# EAGLE design acf-adapter (EAGLE 9.6.2)
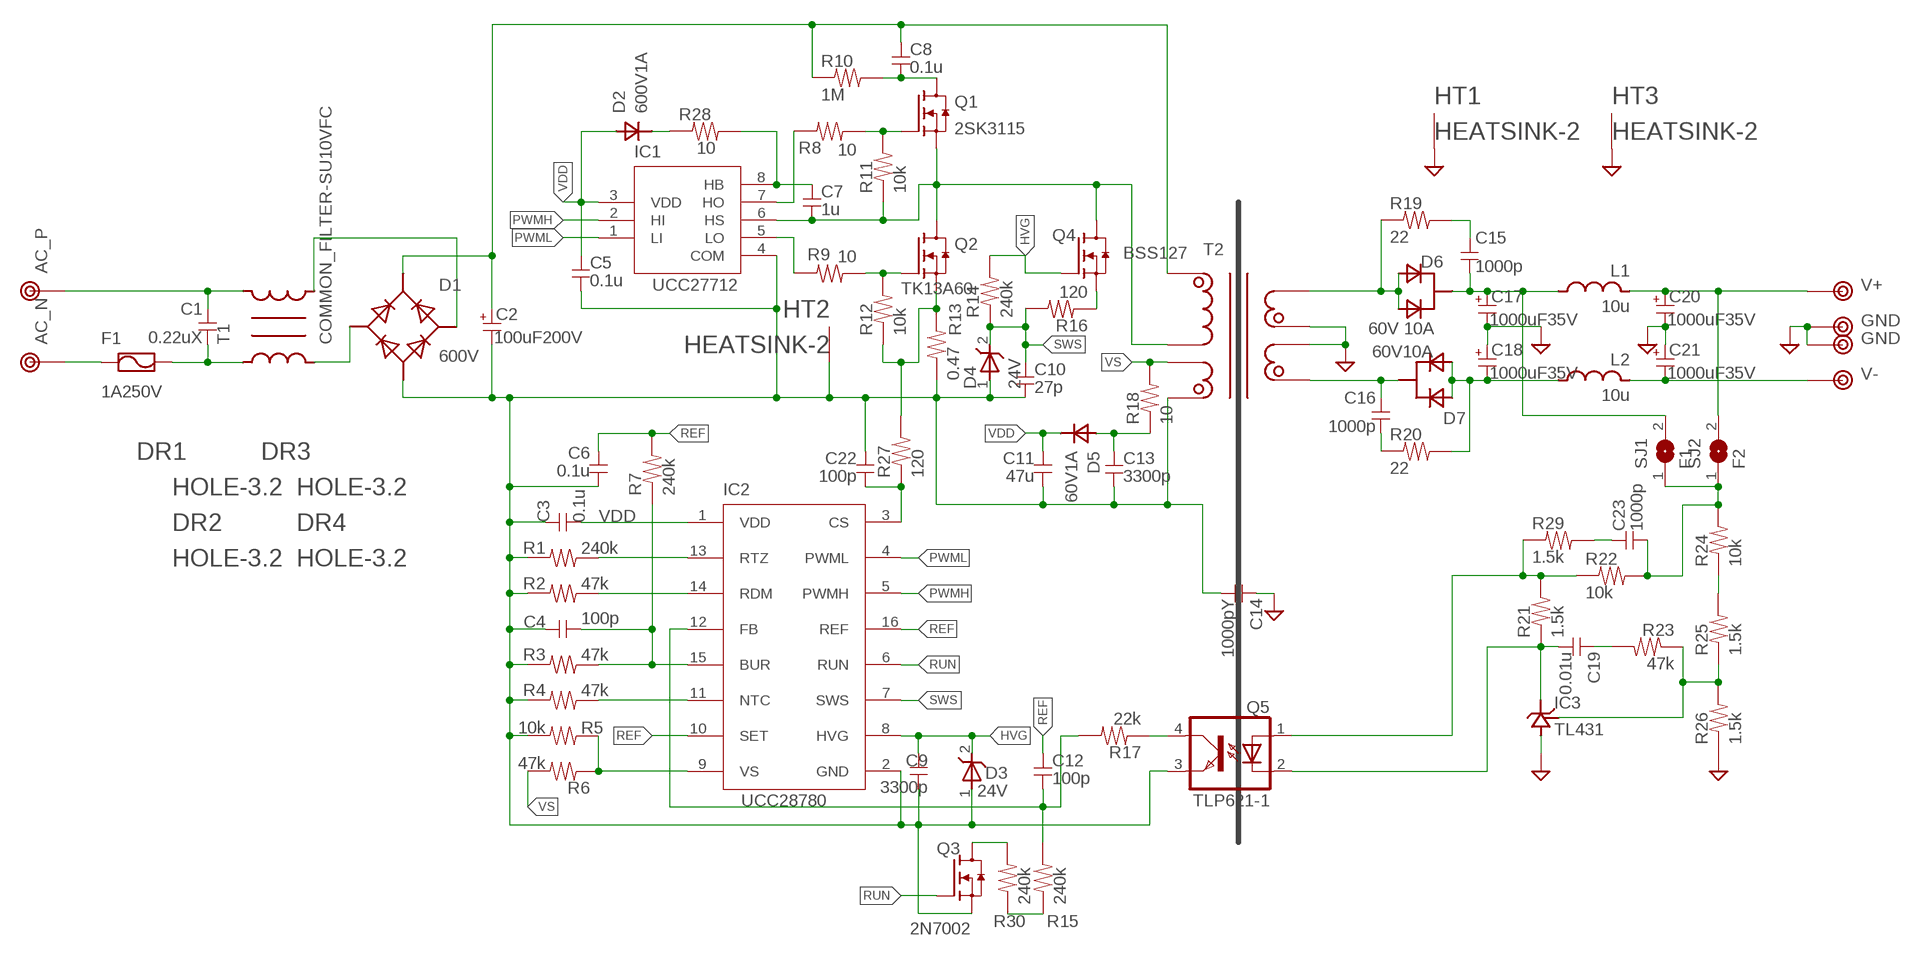
[diagram p0: schematic, sheet 1]

## Parts
C1  0.22uX  C-X  [X-CAPACITER]
C2  100uF200V  CPOLE5-10.5A2  [E5-10,5A2]
C3  0.1u  C-1608  [1608]
C4  100p  C-1608  [1608]
C5  0.1u  C-1608  [1608]
C6  0.1u  C-1608  [1608]
C7  1u  C-1608  [1608]
C8  0.1u  C-7.5  [C075]
C9  3300p  C-1608  [1608]
C10  27p  C-1608  [1608]
C11  47u  C-2012  [2012]
C12  100p  C-1608  [1608]
C13  3300p  C-1608  [1608]
C14  1000pY  C-Y  [Y-CAPACITER]
C15  1000p  C-1608  [1608]
C16  1000p  C-1608  [1608]
C17  1000uF35V  CPOLE5-10  [E5-10]
C18  1000uF35V  CPOLE5-10  [E5-10]
C19  0.01u  C-1608  [1608]
C20  1000uF35V  CPOLE5-10  [E5-10]
C21  1000uF35V  CPOLE5-10  [E5-10]
C22  100p  C-1608  [1608]
C23  1000p  C-1608  [1608]
D1  600V  DIODE4-GBU8A  [GBU8A]
D2  600V1A  DIODE-7  [D0204/7]
D3  24V  ZENER-SMD  [SOD123]
D4  24V  ZENER-SMD  [SOD123]
D5  60V1A  DIODE-7  [D0204/7]
D6  60V 10A  DIODE2  [TO-220]
D7  60V10A  DIODE2  [TO-220]
DR1  HOLE-3.2  [HOLE_3.2]
DR2  HOLE-3.2  [HOLE_3.2]
DR3  HOLE-3.2  [HOLE_3.2]
DR4  HOLE-3.2  [HOLE_3.2]
F1  1A250V  FUSE-5  [FUSE-5]
HT1  HEATSINK-2  [HEATSINK2]
HT2  HEATSINK-2  [HEATSINK2]
HT3  HEATSINK-2  [HEATSINK2]
IC1  UCC27712  [SOP8]
IC2  UCC28780  [SO16]
IC3  TL431  [TO-92]
L1  10u  L-5  [L5-7,5]
L2  10u  L-5  [L5-7,5]
Q1  2SK3115  NMOS  [TO-220]
Q2  TK13A60  NMOS  [TO-220]
Q3  2N7002  NMOS-SMD  [SC59]
Q4  BSS127  NMOS-SMD  [SC59]
Q5  TLP621-1  [DIL04]
R1  240k  R-1608  [1608]
R2  47k  R-1608  [1608]
R3  47k  R-1608  [1608]
R4  47k  R-1608  [1608]
R5  10k  R-1608  [1608]
R6  47k  R-1608  [1608]
R7  240k  R-1608  [1608]
R8  10  R-2012  [2012]
R9  10  R-2012  [2012]
R10  1M  R-7.5  [0204/7]
R11  10k  R-1608  [1608]
R12  10k  R-1608  [1608]
R13  0.47  R-10  [0207/10]
R14  240k  R-1608  [1608]
R15  240k  R-1608  [1608]
R16  120  R-1608  [1608]
R17  22k  R-1608  [1608]
R18  10  R-1608  [1608]
R19  22  R-2.5  [0207/2V]
R20  22  R-2.5  [0207/2V]
R21  1.5k  R-1608  [1608]
R22  10k  R-1608  [1608]
R23  47k  R-1608  [1608]
R24  10k  R-1608  [1608]
R25  1.5k  R-1608  [1608]
R26  1.5k  R-1608  [1608]
R27  120  R-1608  [1608]
R28  10  R-1608  [1608]
R29  1.5k  R-1608  [1608]
R30  240k  R-1608  [1608]
SJ1  F1  SJ1608  [SJ1608]
SJ2  F2  SJ1608  [SJ1608]
T1  COMMON_FILTER-SU10VFC  [SU10VFC]
T2  TRANSFORMAER_FLYBACK-PQ2620-ACF  [BPQ26/20-1112CPFR]
TP1  AC_P  TESTPIN-BIG  [TESTPIN-BIG]
TP2  AC_N  TESTPIN-BIG  [TESTPIN-BIG]
TP3  V+  TESTPIN-BIG  [TESTPIN-BIG]
TP4  GND  TESTPIN-BIG  [TESTPIN-BIG]
TP5  V-  TESTPIN-BIG  [TESTPIN-BIG]
TP6  GND  TESTPIN-BIG  [TESTPIN-BIG]

## Nets
FB: C12.2 IC2.12(FB) R15.2 R17.2
GND: C14.1 C17.- C18.+ C20.- C21.+ HT1.HT1(HT) HT3.HT1(HT) IC3.2(GND) R26.1 T2.9(L3_P) T2.10(L4_N) TP4.1 TP6.1
HVG: C9.1 D3.2(C) IC2.8(HVG) Q4.1(G) R14.2
N$1: F1.1 TP2.1
N$2: C1.2 F1.2 T1.1
N$3: C1.1 T1.4 TP1.1
N$4: D1.2(AC1) T1.2
N$5: D1.3(AC2) T1.3
N$6: C15.2 C17.+ D6.2(K) L1.2 SJ1.2
N$7: Q2.1(G) R9.1 R12.2
N$8: C15.1 R19.2
N$9: C23.2 R22.2 R24.2 SJ1.1 SJ2.1
N$10: C7.1 IC1.8(HB) R28.2
N$11: IC1.7(HO) R8.2
N$12: Q1.1(G) R8.1 R11.2
N$13: C8.2 Q1.2(D) R10.2
N$14: IC1.5(LO) R9.2
N$15: Q2.3(S) R12.1 R13.2 R27.2
N$16: Q4.2(S) R16.1
N$17: D6.1(A1) D6.3(A2) R19.1 T2.7(L3_N) T2.8(L3_N)
N$18: C16.1 D7.2(K) T2.11(L4_P) T2.12(L4_P)
N$19: C13.1 D5.1(A) R18.1
N$20: IC2.13(RTZ) R1.1
N$21: IC2.14(RDM) R2.1
N$22: C16.2 R20.1
N$23: C18.- D7.1(A1) D7.3(A2) L2.2 R20.2
N$24: IC2.11(NTC) R4.1
N$25: R24.1 R25.2
N$26: IC3.1(REF) R23.1 R25.1 R26.2
N$27: C19.1 R23.2
N$28: C19.2 IC3.3(OUT) Q5.2(C) R21.1
N$29: Q5.1(A) R21.2 R22.1 R29.1
N$30: C22.2 IC2.3(CS) R27.1
N$31: D2.2(K) R28.1
N$32: C4.2 IC2.15(BUR) R3.2 R7.1
N$33: C23.1 R29.2
N$34: Q3.3(D) R30.2
N$35: Q5.4(COL) R17.1
N$36: IC2.9(VS) R5.1 R6.1
N$37: R15.1 R30.1
N$40: C7.2 IC1.6(HS) Q1.3(S) Q2.2(D) Q4.3(D) R11.1 T2.1(L1_N)
PGND: C2.- C3.1 C4.1 C5.2 C6.1 C9.2 C10.2 C11.2 C13.2 C14.2 C22.1 D1.4(V-) D3.1(A) D4.1(A) HT2.HT1(HT) IC1.4(COM) IC2.2(GND) Q3.2(S) Q5.3(EMIT) R1.2 R2.2 R3.1 R4.2 R5.2 R13.1 T2.5(L2_P)
PWMH: IC1.2(HI) IC2.5(PWMH)
PWML: IC1.1(LI) IC2.4(PWML)
REF: C6.2 C12.1 IC2.10(SET) IC2.16(REF) R7.2
RUN: IC2.6(RUN) Q3.1(G)
SWS: C10.1 D4.2(C) IC2.7(SWS) R14.1 R16.2
V+: C20.+ L1.1 SJ2.2 TP3.1
V-: C21.- L2.1 TP5.1
VDD: C3.2 C5.1 C11.1 D2.1(A) D5.2(K) IC1.3(VDD) IC2.1(VDD)
VP: C2.+ C8.1 D1.1(V+) R10.1 T2.3(L1_P)
VS: R6.2 R18.2 T2.6(L2_N)

## Library data of the parts
C1 C3-C16 C19 C22 C23 = my_rcl:C
C2 C17 C18 C20 C21 = my_rcl:CPOL
D1 = my_rcl:DIODE4
D2 D5 = my_rcl:DIODE
D3 D4 = my_rcl:ZENER
D6 D7 = my_rcl:DIODE2
DR1-DR4 = my_connector:HOLE-3.2
F1 = my_rcl:FUSE
HT1-HT3 = my_connector:HEATSINK
IC1 = my_ic:UCC27712
IC2 = my_ic:UCC28780
IC3 = my_ic:TL431
L1 L2 = my_rcl:L
Q1-Q4 = my_ic:NMOS
Q5 = my_ic:TLP621-1: Photocoupler
R1-R30 = my_rcl:R
SJ1 SJ2 = Connector_Robotech:SJ: SMD solder JUMPER
T1 = my_rcl:COMMON_FILTER
T2 = my_rcl:TRANSFORMAER_FLYBACK
TP1-TP6 = my_connector:TESTPIN

## Board
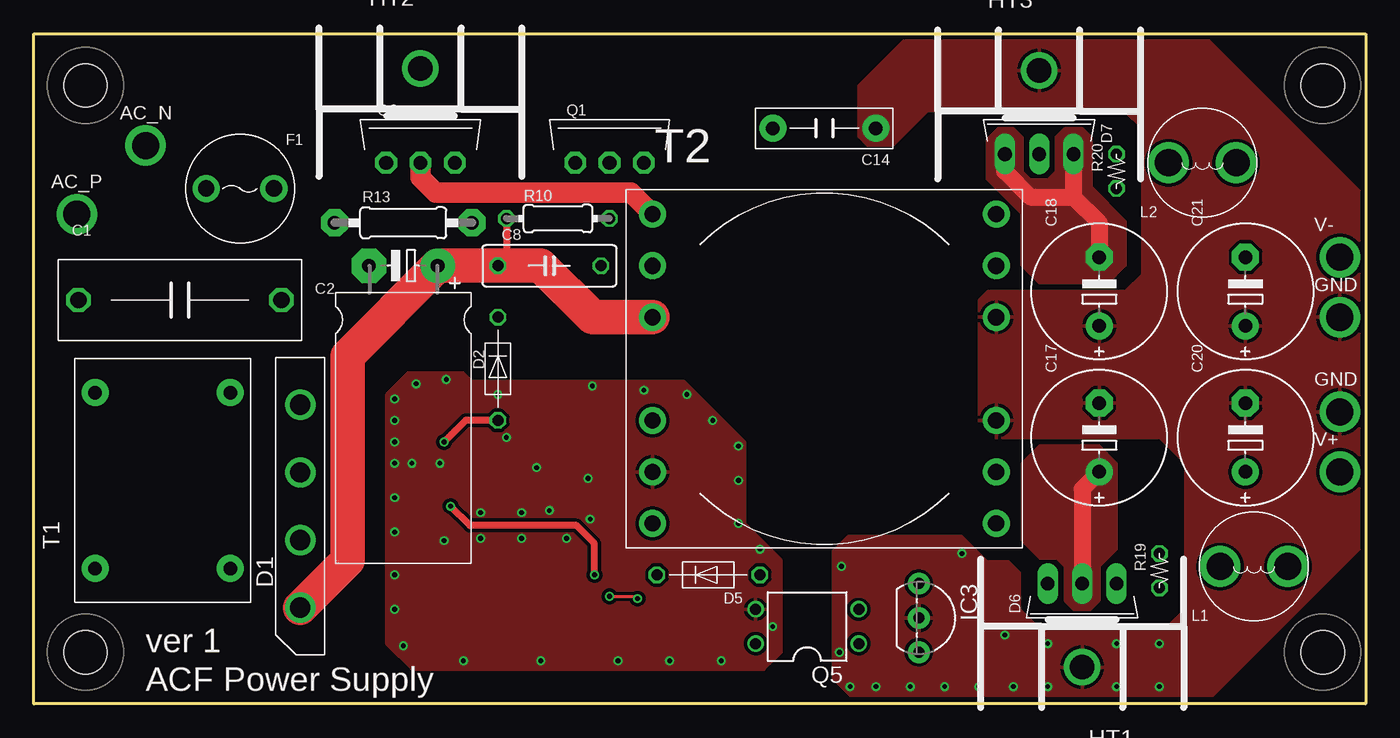
[diagram p1: board, top side]
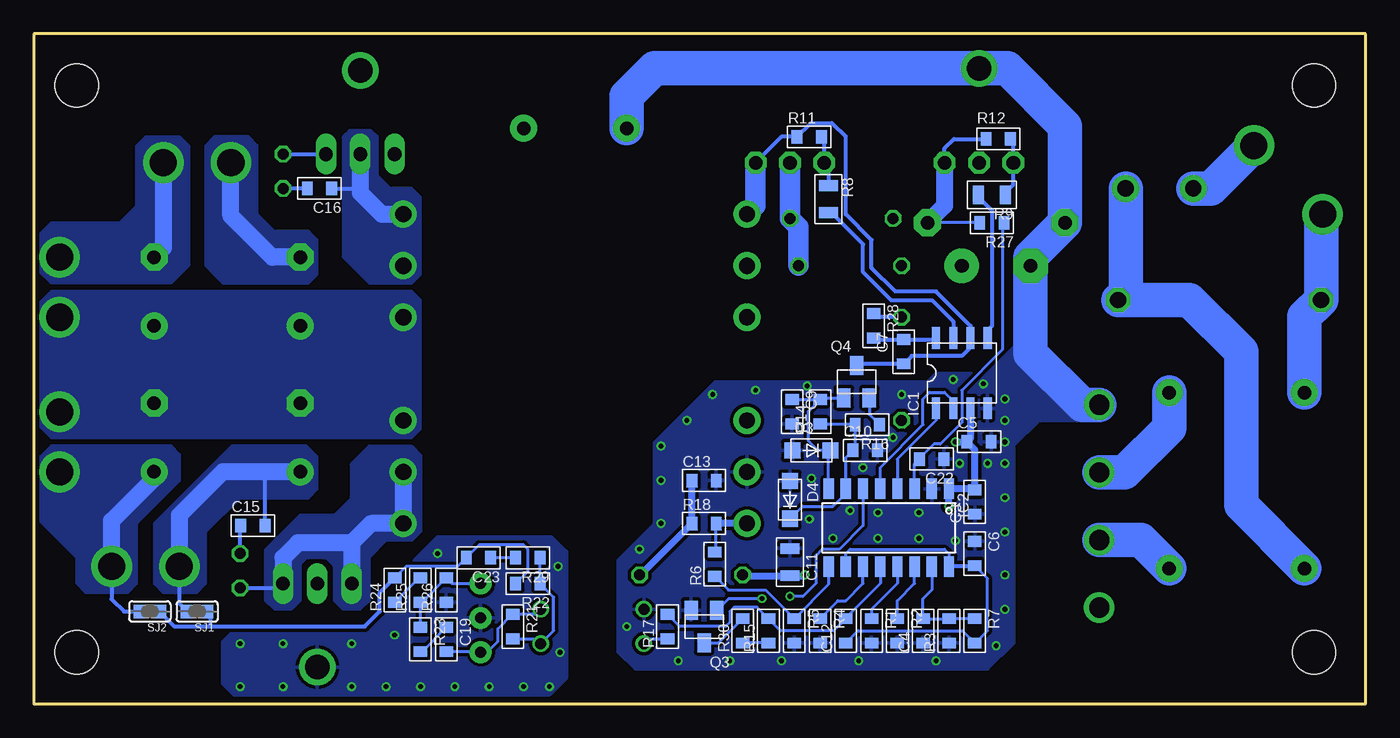
[diagram p2: board, bottom side, seen from below]

Size 98.42 x 49.53 mm. Coordinates in mm from the lower left corner, seen from the top.
Outline: 98.42,0 0,0 0,49.53 98.42,49.53 98.42,0
Copper layers (1*16): Top 0.035mm / dielectric 1.5mm / Bottom 0.035mm
Design rules "SeeedStudio_2layer_DRU_20140221": minimum track width 6mil, minimum drill 0.3mm, track to track 8mil, track to pad 8mil, pad to pad 8mil, via to via 12mil, smd to smd 0mil, copper to edge 0.3mm, drill to drill 10mil, minimum pad ring 0.15mm, minimum via ring 6mil, stop-mask expansion 2mil, vias tented up to drill 1mm, thermal gap 10mil

### Footprints (pad centres in the part's own frame; a part is rotated, then mirrored left to right if it is on the bottom)
X-CAPACITER = drill 1.2 octagon: 1 -7.5,0; 2 7.5,0
E5-10,5A2 = drill 1.016 pad 2.54: + -2.54,0 | drill 1.016 pad 2.54 octagon: - 2.54,0
1608 = smd 0.8 x 1: 1 -0.9,0; 2 0.9,0
C075 = drill 0.813 octagon: 1 -3.81,0; 2 3.81,0
2012 = smd 0.8 x 1.4: 1 -1,0; 2 1,0
Y-CAPACITER = drill 1 pad 2: 1 -3.81,0; 2 3.81,0
E5-10 = drill 1 pad 2: + -2.54,0 | drill 1 pad 2 octagon: - 2.54,0
GBU8A = drill 1.5: 1 -7.5,0; 2 -2.5,0; 3 2.5,0; 4 7.5,0
D0204/7 = drill 0.813 octagon: 1 -3.81,0; 2 3.81,0
SOD123 = smd 1.2 x 1.2: 1 -1.4,0; 2 1.4,0
TO-220 = drill 1.016 long: 1 -2.54,0; 2 0,0; 3 2.54,0
HOLE_3.2 = hole 3.2: 0,0
FUSE-5 = drill 1.2 pad 2: 1 -2.5,0; 2 2.5,0
HEATSINK2 = drill 1.8: HT1 0,3
SOP8 = smd 0.6 x 1.6: 1 -1.905,-2.6; 2 -0.635,-2.6; 3 0.635,-2.6; 4 1.905,-2.6; 5 1.905,2.6; 6 0.635,2.6; 7 -0.635,2.6; 8 -1.905,2.6
SO16 = smd 0.762 x 1.524: 1 -4.445,-2.875; 2 -3.175,-2.875; 3 -1.905,-2.875; 4 -0.635,-2.875; 5 0.635,-2.875; 6 1.905,-2.875; 7 3.175,-2.875; 8 4.445,-2.875; 9 4.445,2.875; 10 3.175,2.875; 11 1.905,2.875; 12 0.635,2.875; 13 -0.635,2.875; 14 -1.905,2.875; 15 -3.175,2.875; 16 -4.445,2.875
TO-92 = drill 0.813 pad 1.6: 1 -2.54,0; 2 0,0; 3 2.54,0
L5-7,5 = drill 2 pad 3: 1 -2.5,0; 2 2.5,0
TO-220' = drill 1 pad 1.6 octagon: 1 -2.54,0; 2 0,0; 3 2.54,0
SC59 = smd 1 x 1.4: 1 -0.95,-1.2; 2 0.95,-1.2; 3 0,1.2
DIL04 = drill 0.813: 1 -1.27,-3.81; 2 1.27,-3.81; 3 1.27,3.81; 4 -1.27,3.81
0204/7 = drill 0.813 octagon: 1 -3.81,0; 2 3.81,0
0207/10 = drill 1 pad 2 octagon: 1 -5.08,0; 2 5.08,0
0207/2V = drill 0.813 octagon: 1 -1.27,0; 2 1.27,0
SJ1608 = smd 1.016 x 1.016: 1 -0.697,0; 2 0.697,0
SU10VFC = drill 1 pad 2: 1 -6.5,5; 2 -6.5,-5; 3 6.5,-5; 4 6.5,5
BPQ26/20-1112CPFR = drill 1.2 pad 2: 1 -12.7,11.43; 2 -12.7,7.62; 3 -12.7,3.81; 4 -12.7,-3.81; 5 -12.7,-7.62; 6 -12.7,-11.43; 7 12.7,-11.43; 8 12.7,-7.62; 9 12.7,-3.81; 10 12.7,3.81; 11 12.7,7.62; 12 12.7,11.43
TESTPIN-BIG = drill 2: 1 0,0

### Placement (x,y rotation side)
C1  10.79,29.84 0 top
C2  27.3,32.38 180 top
C3  28.89,14.92 90 bottom
C4  32.7,5.4 90 bottom
C5  28.57,19.37 0 bottom
C6  28.89,11.11 270 bottom
C7  34.13,26.04 270 bottom
C8  38.1,32.38 0 top
C9  42.39,21.59 270 bottom
C10  36.99,18.73 0 bottom
C11  42.55,10.48 90 bottom
C12  38.42,5.4 90 bottom
C13  48.9,16.51 0 bottom
C14  58.42,42.55 180 top
C15  82.23,13.18 0 bottom
C16  77.31,38.1 180 bottom
C17  78.74,19.68 90 top
C18  78.74,30.48 90 top
C19  67.94,4.76 270 bottom
C20  89.53,19.68 90 top
C21  89.53,30.48 90 top
C22  32.07,18.1 180 bottom
C23  65.56,10.79 180 bottom
D1  19.68,14.61 90 top
D2  34.29,24.77 90 top
D3  40.96,18.73 0 bottom
D4  42.55,15.08 270 bottom
D5  49.85,9.53 180 top
D6  77.47,8.89 180 top
D7  74.3,40.64 0 top
DR1  95.25,45.72 0 top
DR2  95.25,3.81 0 top
DR3  3.81,3.81 0 top
DR4  3.81,45.72 0 top
F1  15.24,38.1 0 top
HT1  77.47,5.71 180 top
HT2  28.57,43.97 0 top
HT3  74.3,43.81 0 top
IC1  29.84,24.45 0 bottom
IC2  35.24,13.02 180 bottom
IC3  65.41,6.35 270 top
L1  90.17,10.16 180 top
L2  86.36,40.01 180 top
Q1  2SK3115  [TO-220']  42.55,40.01 0 top
Q2  TK13A60  [TO-220']  28.57,40.01 0 top
Q3  48.9,5.71 180 bottom
Q4  37.62,23.81 0 bottom
Q5  57.15,5.71 90 top
R1  36.51,5.4 270 bottom
R2  34.61,5.4 270 bottom
R3  30.8,5.4 90 bottom
R4  40.32,5.4 270 bottom
R5  42.23,5.4 270 bottom
R6  48.1,10.32 90 bottom
R7  28.89,5.4 270 bottom
R8  39.69,37.31 270 bottom
R9  27.62,37.62 180 bottom
R10  38.73,35.88 0 top
R11  41.12,41.91 0 bottom
R12  27.15,41.75 0 bottom
R13  27.3,35.56 0 top
R14  40.32,21.59 90 bottom
R15  44.13,5.4 90 bottom
R16  36.83,20.64 180 bottom
R17  51.59,5.71 90 bottom
R18  48.9,13.34 0 bottom
R19  83.19,9.84 90 top
R20  80.01,39.37 90 top
R21  63.02,5.71 270 bottom
R22  61.91,8.89 180 bottom
R23  69.85,4.76 270 bottom
R24  71.75,8.41 90 bottom
R25  69.85,8.41 90 bottom
R26  67.94,8.41 90 bottom
R27  27.62,35.56 180 bottom
R28  36.35,27.94 270 bottom
R29  61.91,10.79 180 bottom
R30  46.04,5.4 90 bottom
SJ1  86.36,6.83 180 bottom
SJ2  89.85,6.83 180 bottom
T1  9.53,16.51 90 top
T2  58.42,24.77 0 top
TP1  3.17,36.2 0 top
TP2  8.26,41.27 0 top
TP3  96.52,17.14 0 top
TP4  96.52,21.59 0 top
TP5  96.52,33.02 0 top
TP6  96.52,28.57 0 top

### Tracks (layer width: path | path; a pad name or v marks a point on that pad's centre or on a via)
FB
  Bottom 0.203: IC2.12 35.88,8.89 38.42,6.35 C12.2 39.32,5.4 43.23,5.4 R15.2 44.98,7.14 46.67,7.14 46.99,6.83 46.99,6.03 47.31,5.71 50.69,5.71 R17.2
GND  (via drill 0.35)
  other vias: 62.23,1.27 64.77,1.27 67.31,1.27 69.85,1.27 72.39,1.27 74.93,1.27 80.01,1.27 83.19,1.27 83.19,4.45 80.01,4.45 74.93,4.45 71.75,5.08 59.53,3.81 59.69,10.16 68.58,11.11 60.33,1.27
  pour Bottom (no thermals): 97.16,30.48 98.42,29.21 98.42,20.95 97.16,19.68 70.48,19.68 69.85,20.32 69.85,29.84 70.48,30.48
  pour Bottom (isolate 0.254): 60.17,12.38 59.05,11.27 59.05,1.91 60.33,0.64 83.66,0.64 84.45,1.43 84.45,4.6 83.34,5.71 74.14,5.71 72.87,6.99 72.87,9.68 72.07,10.48 70.48,10.48 68.58,12.38
  pour Top (isolate 0.254): 60.17,12.38 59.05,11.27 59.05,1.91 60.33,0.64 84.3,0.64 84.3,5.71 74.14,5.71 72.87,6.99 72.87,9.68 72.07,10.48 70.48,10.48 68.58,12.38
  pour Top (isolate 0.254): 80.64,30.48 70.48,30.48 69.85,29.84 69.85,20.32 70.48,19.68 83.19,19.68 85.09,17.78 85.09,0.64 87.15,0.64 98.42,11.91 98.42,37.47 86.36,49.53 69.85,49.53 69.85,43.81 80.64,43.81 81.92,42.55 81.92,31.75
  pour Top (isolate 0.254): 85.09,6.99 83.82,5.71 75.56,5.71 75.56,0.64 86.36,0.64 86.36,6.99
  pour Top (no thermals): 69.85,49.53 69.85,43.81 66.04,43.81 63.5,41.27 61.59,41.27 60.96,41.91 60.96,45.72 64.77,49.53
HVG
  Bottom 0.203: R14.2 40.2,22.61 Q4.1 | C9.1 R14.2 | IC2.8 39.69,18.6 D3.2 40.48,18.73 41.2,19.45 41.2,21.62 R14.2
N$1
  Bottom 2.54: F1.1 11.43,38.1 TP2.1
N$2
  Bottom 2.54: T1.1 9.21,14.69 9.21,26.04 13.02,29.84 C1.2 17.74,29.85 F1.2
N$3
  Bottom 2.54: T1.4 4.53,28.61 C1.1 3.29,36.08 TP1.1
N$4
  Bottom 2.54: D1.2 16.62,12.11 T1.2
N$5
  Bottom 2.54: D1.3 17.82,17.11 14.53,20.4 T1.3
N$6
  Top 1.27: C17.+ 77.47,15.88 D6.2
  Bottom 0.305: L1.2 87.67,7.44 SJ1.2 | C15.2 81.33,17.09 81.28,17.14
  Bottom 1.27: C17.+ 81.28,17.14 84.45,17.14 87.67,13.93 L1.2
  pour Top (no thermals): 78.74,19.05 74.3,19.05 73.03,17.78 73.03,12.06 74.3,10.79 75.56,10.79 76.2,10.16 76.2,7.62 76.83,6.99 78.11,6.99 78.74,7.62 78.74,10.16 80.01,11.43 80.01,17.78
  pour Bottom (no thermals): 89.53,13.34 89.53,8.89 88.9,8.26 86.36,8.26 85.72,8.89 85.72,12.7 83.19,15.24 78.11,15.24 77.47,15.88 77.47,18.26 78.26,19.05 83.82,19.05
N$7
  Bottom 0.305: R12.2 26.19,41.75 26.04,41.59 Q2.1 26.04,38.37 26.62,37.78 R9.1
N$8
  Bottom 0.305: R19.2 83.19,13.12 C15.1
N$9
  Bottom 0.203: R24.2 70.91,10.16 67.1,10.16 C23.2 65.51,11.75 62.23,11.75 61.91,11.43 61.91,9.79 R22.2
  Bottom 0.305: SJ2.1 88.04,5.71 85.41,5.71 | SJ1.1 85.41,6.57 85.41,5.71 | R24.2 72.87,8.2 72.87,6.83 73.98,5.71 85.41,5.71
N$10
  Bottom 0.305: R28.2 36.25,26.93 C7.1 31.86,26.93 IC1.8
N$11
  Bottom 0.305: IC1.7 30.48,28.26 32.07,29.84 35.08,29.84 37.15,31.91 37.15,33.97 39.48,36.31 R8.2
N$12
  Bottom 0.305: R8.1 39.69,39.69 Q1.1 40.01,41.7 R11.2
N$13
  Bottom 1.524: Q1.2 R10.2 41.91,35.24 C8.2
N$14
  Bottom 0.305: IC1.5 27.94,27.62 27.62,27.94 27.62,36.47 28.62,37.47 R9.2
N$15
  Bottom 0.203: R27.2 R13.2
  Bottom 0.305: Q2.3 31.11,41.06 30.43,41.75 R12.1
  Bottom 1.27: Q2.3 31.11,36.83 R13.2
N$16
  Bottom 0.203: Q4.2 36.67,21.38 R16.1
N$17
  Bottom 0.305: R19.1 80.33,8.57 D6.1
  Bottom 1.27: T2.8 T2.7 73.5,13.34 74.93,11.91 | 74.93,11.91 D6.3 | 74.93,11.91 78.9,11.91 80.01,10.79 D6.1
  pour Bottom (no thermals): 73.66,19.05 70.48,19.05 69.85,18.41 69.85,12.7 70.48,12.06 72.39,12.06 73.66,10.79 73.66,7.62 74.3,6.99 75.56,6.99 76.2,7.62 76.2,10.16 76.83,10.79 78.26,10.79 78.74,10.32 78.74,7.62 79.38,6.99 80.64,6.99 81.28,7.62 81.28,11.43 78.74,13.97 76.2,13.97 74.93,15.24 74.93,17.78
N$18
  Bottom 0.305: C16.1 74.61,38.1 74.3,37.78
  Bottom 1.27: D7.2 74.3,37.78 72.71,36.2 T2.12
  pour Bottom (no thermals): 75.56,41.91 75.56,33.02 73.66,31.11 70.48,31.11 69.85,31.75 69.85,37.47 70.48,38.1 72.07,38.1 73.03,39.05 73.03,41.91 73.5,42.39 75.09,42.39
N$19
  Bottom 0.508: C13.1 R18.1 53.6,9.53 D5.1
N$20
  Bottom 0.203: IC2.13 34.61,8.89 36.51,6.99 R1.1
N$21
  Bottom 0.203: R2.1 34.61,7.62 33.34,8.89 IC2.14
N$22
  Bottom 0.305: C16.2 R20.1
N$23
  Top 1.27: D7.1 71.75,39.37 73.66,37.47 76.83,37.47 | 76.83,37.47 78.74,35.56 C18.- | D7.3 76.83,37.47
  Bottom 0.305: R20.2 D7.3
  Bottom 1.27: C18.- 80.8,33.02 83.86,36.08 L2.2
  pour Top (no thermals): 79.38,31.11 74.3,31.11 73.03,32.38 73.03,36.2 70.48,38.73 70.48,41.75 71.28,42.55 72.39,42.55 73.03,41.91 73.03,39.37 73.66,38.73 74.93,38.73 75.56,39.37 75.56,41.91 76.2,42.55 77.47,42.55 78.11,41.91 78.11,38.26 80.64,35.72 80.64,32.38
  pour Bottom (no thermals): 85.72,41.27 85.72,32.38 84.45,31.11 78.11,31.11 77.47,31.75 77.47,34.29 78.11,34.92 80.64,34.92 81.92,36.2 81.92,41.27 82.55,41.91 85.09,41.91
N$24
  Bottom 0.203: R4.1 39,7.62 38.42,7.62 37.15,8.89 IC2.11
N$25
  Bottom 0.203: R24.1 69.95,9.31 R25.2
N$26
  Bottom 0.203: R23.1 R25.1 69.75,7.51 R26.2 67.52,8.89 IC3.1
N$27
  Bottom 0.203: C19.1 69.75,3.86 R23.2
N$28
  Bottom 0.203: Q5.2 61.33,6.62 R21.1 63.08,6.62 64.14,5.56 64.14,4.6 64.93,3.81 IC3.3 65.46,3.86 C19.2
N$29
  Bottom 0.203: R21.2 61.33,4.82 Q5.1 60.01,5.4 60.01,7.88 R22.1 R29.1
N$30
  Bottom 0.203: R27.1 26.83,35.45 26.83,26.19 29.84,23.18 29.84,20.8 31.43,19.21 31.91,19.21 32.97,18.15 C22.2 33.34,17.73 IC2.3
N$31
  Bottom 0.305: D2.2 36.09,28.57 R28.1
N$32
  Bottom 0.203: IC2.15 32.07,8.41 32.7,7.78 C4.2 R3.2 R7.1
N$33
  Bottom 0.203: R29.2 C23.1
N$34
  Bottom 0.203: Q3.3 47.82,4.51 R30.2
N$35
  Bottom 0.203: Q5.4 52.97,4.82 R17.1
N$36
  Bottom 0.203: IC2.9 39.69,8.84 R5.1 44.34,8.41 47.1,8.41 R6.1
N$37
  Bottom 0.203: R15.1 R30.1
N$40
  Top 1.524: Q2.2 28.57,38.89 29.69,37.78 44.13,37.78 T2.1
  Bottom 0.203: 37.6,25.04 Q4.3
  Bottom 0.305: Q1.3 43.18,41.91 R11.1 40.98,42.94 39.45,42.94 38.42,41.91 38.42,36.2 36.51,34.29 36.51,32.23 34.77,30.48 31.75,30.48 29.21,27.94 IC1.6 29.21,26.35 29.84,25.72 33.55,25.72 C7.2 37.5,25.14 37.6,25.04
  Bottom 1.524: Q1.3 45.09,36.83 T2.1
PGND  (via drill 0.35)
  Bottom 2.54: D1.4 20.95,22.11 24.77,25.91 C2.- 24.77,33.02 R13.1 22.23,42.7 26.5,46.97 HT2.HT1 52.56,46.97 54.61,44.93 C14.2
  other vias: 34.92,19.68 37.15,17.46 30,17.78 33.02,14.13 36.04,14.13 33.02,12.22 36.04,12.22 30.32,12.06 27.3,4.29 31.75,3.17 37.47,3.17 43.18,3.17 46.99,3.17 50.8,3.17 54.61,5.71 53.66,11.43 52.07,13.34 52.07,16.51 52.07,19.05 50.16,20.95 48.26,22.86 45.09,23.18 41.27,23.5 40.96,16.67 30.48,23.97 28.26,23.65 26.67,22.54 26.67,20.95 26.67,19.37 26.67,17.78 27.94,17.78 34.29,22.86 26.67,12.7 26.67,9.53 26.67,6.99 26.67,15.24 39.37,12.22 38.1,14.29 41.12,13.65
  pour Bottom (isolate 0.254): 48.1,23.81 32.38,23.81 31.75,24.45 27.62,24.45 26.04,22.86 26.04,4.45 27.94,2.54 53.98,2.54 55.24,3.81 55.24,10.64 52.55,13.34 52.55,19.37
  pour Top (isolate 0.254): 27.62,24.45 26.04,22.86 26.04,4.45 27.94,2.54 53.98,2.54 55.24,3.81 55.24,10.64 52.55,13.34 52.55,19.37 48.1,23.81 32.38,23.81 31.75,24.45
  pour Bottom (isolate 0.254): 26.04,19.05 24.13,20.95 20.16,20.95 20.16,22.86 24.29,26.99 25.4,26.99 27.94,24.45 27.94,19.05
PWMH
  Bottom 0.203: IC2.5 35.88,17.46 32.7,20.64 32.7,22.54 32.23,23.02 31.11,23.02 30.48,22.38 IC1.2
PWML
  Bottom 0.203: IC1.1 31.75,20.95 34.61,18.1 IC2.4
REF
  Bottom 0.203: IC2.10 38.42,11.11 38.1,11.43 31.11,11.43 30.8,11.11 IC2.16 | C12.1 37.52,5.4 29.79,5.4 R7.2 28.84,4.5 27.94,5.4 27.94,9.26 C6.2
  Bottom 0.305: IC2.16 30.73,10.21 C6.2
RUN  (via drill 0.35)
  Top 0.203: v42.55,7.94 44.45,7.94 v44.61,7.78
  Bottom 0.203: IC2.6 37.15,13.18 38.89,11.43 40.16,11.43 40.64,10.95 40.64,8.89 41.59,7.94 v42.55,7.94 | v44.61,7.78 47.08,7.78 Q3.1
SWS
  Bottom 0.203: R14.1 37.78,20.69 R16.2 37.73,18.89 C10.1 38.42,18.2 IC2.7 38.42,15.56 39.37,14.61 41.62,14.61 D4.2
V+
  Bottom 0.305: L1.1 92.67,7.74 91.76,6.83 SJ2.2
  Bottom 1.27: L1.1 92.67,13.53 89.53,16.67 C20.+
  pour Bottom (no thermals): 94.61,8.26 91.44,8.26 90.81,8.89 90.81,13.34 87.63,16.51 87.63,18.41 88.27,19.05 97.16,19.05 98.42,17.78 98.42,13.97 95.25,10.79 95.25,8.89
V-
  Bottom 1.27: L2.1 88.86,33.7 C21.-
  pour Bottom (no thermals): 87,41.27 87,32.38 88.27,31.11 97.16,31.11 98.42,32.38 98.42,34.29 97.16,35.56 92.08,35.56 90.81,36.83 90.81,41.27 90.17,41.91 87.63,41.91
VDD  (via drill 0.35)
  Top 0.508: v30.8,14.61 32.23,13.18 40.12,13.18 41.43,11.86 v41.43,9.53 | v30.32,19.37 31.91,20.95 D2.1
  Bottom 0.508: D5.2 45.99,9.48 C11.1 41.48,9.48 v41.43,9.53 | v30.8,14.61 IC2.1 28.96,15.89 C3.2 28.89,18.79 C5.1 | IC1.3 29.21,19.63 C5.1 | v30.32,19.37 C5.1
VP
  Top 0.508: R10.1 34.92,33.02 C8.1
  Top 2.54: D1.1 23.18,10.6 23.18,25.72 C2.+ C8.1 37.47,32.38 41.27,28.57 T2.3
VS
  Bottom 0.203: R6.2 47.99,11.32 R18.2
  Bottom 0.508: T2.6 R18.2

### Text on the board
tPlace: ver 1 | ACF Power Supply